# EAGLE schematic MegaShieldDB (EAGLE 6.4)
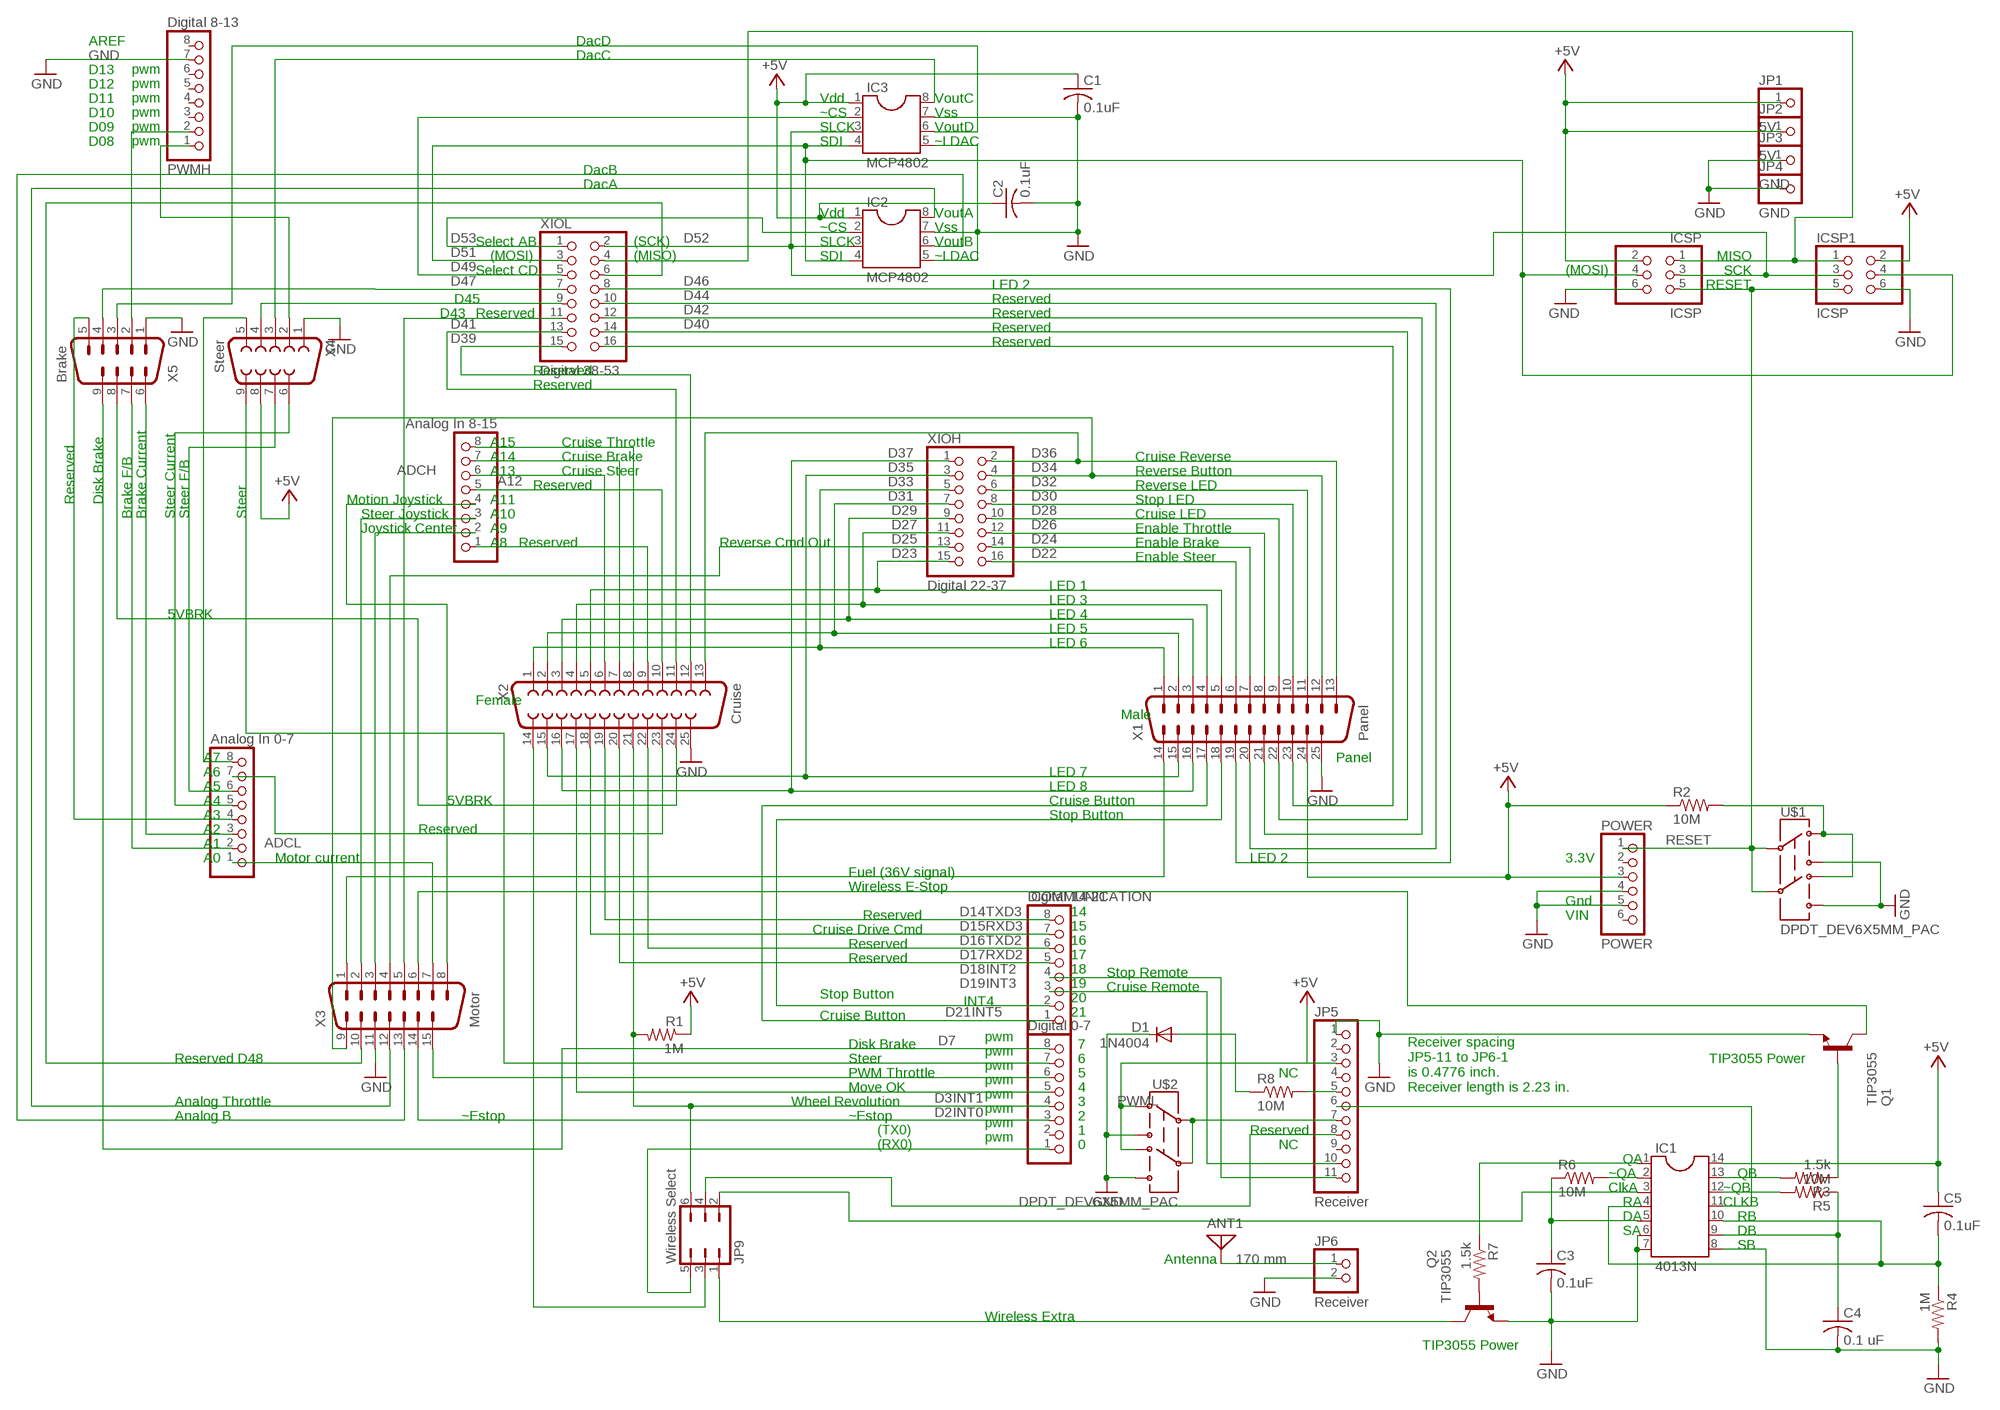
[diagram p0: schematic, sheet 1]

## Parts
ADCH  Analog In 8-15  PINHD-1X8  [1X08]
ADCL  Analog In 0-7  PINHD-1X8  [1X08]
ANT1  170 mm  ANTENNA  [PAD-01]
C1  0.1uF  C-US025-025X050  [C025-025X050]
C2  0.1uF  C-US025-025X050  [C025-025X050]
C3  0.1uF  C-US025-025X050  [C025-025X050]
C4  0.1 uF  C-US025-025X050  [C025-025X050]
C5  0.1uF  C-US025-025X050  [C025-025X050]
COMMUNICATION  Digital 14-21  PINHD-1X8  [1X08]
D1  1N4004  [DO41-10]
IC1  4013N  DIL14  [DIL14]
IC2  MCP4802  DIL8  [DIL08]
IC3  MCP4802  DIL8  [DIL08]
ICSP  ICSP  PINHD-2X3  [2X03]
ICSP1  ICSP  PINHD-2X3  [2X03]
JP1  5V  PINHD-1X1  [1X01]
JP2  5V  PINHD-1X1  [1X01]
JP3  GND  PINHD-1X1  [1X01]
JP4  GND  PINHD-1X1  [1X01]
JP5  Receiver  PINHD-1X11  [1X11]
JP6  Receiver  PINHD-1X2  [1X02]
JP9  Wireless Select  JP3Q  [JP3Q]
POWER  POWER  PINHD-1X6  [1X06]
PWMH  Digital 8-13  PINHD-1X8  [1X08]
PWML  Digital 0-7  PINHD-1X8  [1X08]
Q1  TIP3055  BD239  [TO220]
Q2  TIP3055  BD239  [TO220]
R1  1M  R-US_0204/5  [0204/5]
R2  10M  R-US_0204/5  [0204/5]
R3  1.5k  R-US_0204/5  [0204/5]
R4  1M  R-US_0204/5  [0204/5]
R5  10M  R-US_0204/5  [0204/5]
R6  10M  R-US_0204/5  [0204/5]
R7  1.5k  R-US_0204/5  [0204/5]
R8  10M  R-US_0204/5  [0204/5]
U$1  DPDT_DEV6X5MM_PAC  [NEWSWITCH2_PAC]
U$2  DPDT_DEV6X5MM_PAC  [NEWSWITCH2_PAC]
X1  Panel  M25-HD-20  [M25-HD-20]
X2  Cruise  F25H  [F25H]
X3  Motor  M15-182  [182-015-MALE]
X4  Steer  F09H  [F09H]
X5  Brake  M09-182  [182-009-MALE]
XIOH  Digital 22-37  PINHD-2X8  [2X08]
XIOL  Digital 38-53  PINHD-2X8  [2X08]

## Nets
5VBRK: X2.24 X5.8
+5V: C1.1 C2.1 C5.1 IC1.14 IC2.1 IC3.1 ICSP1.2 ICSP.2 JP1.1 JP2.1 JP5.3 POWER.3 R1.1 R2.1 U$2.PIN1 U$2.PIN4 X1.24 X4.8
A0: ADCL.1 X3.7
A1: ADCL.2 X5.7
A4: ADCL.5 X4.6
A5: ADCL.6 X4.7
A6: ADCL.7 X2.23
A7: ADCL.8 X4.5
A9: ADCH.2 X3.3
A10: ADCH.3 X3.2
A11: ADCH.4 X3.8
A12: ADCH.5 X2.10
A13: ADCH.6 X2.6
A14: ADCH.7 X2.7
A15: ADCH.8 X2.8
CLKA: IC1.3 JP9.2
CLKB: IC1.11 JP5.6
D0RX0: JP9.5 PWML.1
D2INT0: PWML.3 X3.14
D3INT1: JP9.6 PWML.4 R1.2 X2.21
D4: PWML.5 X2.17
D5: PWML.6 X3.15
D6: PWML.7 X4.9
D7: PWML.8 X5.9
D8: PWMH.1 X4.2
D9: PWMH.2 X5.2
D14TXD3: COMMUNICATION.8 X2.19
D15RXD3: COMMUNICATION.7 X2.18
D16TXD2: COMMUNICATION.6 X2.22
D17RXD2: COMMUNICATION.5 X2.20
D18INT2: COMMUNICATION.4 JP5.11
D19INT3: COMMUNICATION.3 JP5.10
D20INT4: COMMUNICATION.2 X1.18
D21INT5: COMMUNICATION.1 X1.17
D22: X1.6 XIOH.16
D23: X1.5 X2.5 XIOH.15
D24: X1.7 XIOH.14
D25: X3.4 XIOH.13
D26: X1.8 XIOH.12
D27: X1.4 X2.4 XIOH.11
D28: X1.9 XIOH.10
D29: X1.3 X2.3 XIOH.9
D30: X1.10 XIOH.8
D31: X1.2 X2.2 XIOH.7
D32: X1.11 XIOH.6
D33: X1.1 X2.1 XIOH.5
D34: X1.12 X3.9 XIOH.4
D35: X1.15 X2.15 XIOH.3
D36: X1.13 X2.13 XIOH.2
D37: X1.16 X2.16 XIOH.1
D38: X1.23 XIOL.16
D39: X2.12 XIOL.15
D40: X1.22 XIOL.14
D41: X2.11 XIOL.13
D42: X1.21 XIOL.12
D43: X3.5 XIOL.11
D44: X1.20 XIOL.10
D45: X4.4 XIOL.9
D46: X1.19 XIOL.8
D47: X5.4 XIOL.7
D48: X3.10 XIOL.6
D49: IC3.2 XIOL.5
D51: IC2.4 IC3.4 ICSP1.4 ICSP.4 XIOL.3
D52: IC2.3 IC3.3 ICSP1.3 ICSP.3 XIOL.2
D53: IC2.2 XIOL.1
DA: C3.1 IC1.5 R6.1
DACA: IC2.8 X3.12
DACB: IC2.6 X3.13
DACC: IC3.8 X4.3
DACD: IC3.6 X5.3
DB: C4.1 IC1.9 R5.1
FUEL: X1.14 X3.1
GND: C1.2 C2.2 C3.2 C4.2 D1.C IC1.6 IC1.7 IC1.8 IC2.5 IC2.7 IC3.5 IC3.7 ICSP1.6 ICSP.6 JP3.1 JP4.1 JP5.1 JP6.2 POWER.4 POWER.5 PWMH.7 Q1.3(E) Q2.3(E) R4.2 U$1.PIN3 U$1.PIN6 U$2.PIN3 U$2.PIN6 X1.25 X2.25 X3.11 X4.1 X5.1
N$1: ADCL.3 X5.6
N$2: IC1.1 R7.1
N$3: Q2.1(B) R7.2
N$4: IC1.13 R3.2
N$5: ADCH.1 X2.9
N$6: R2.2 U$1.PIN1 U$1.PIN4
N$7: IC1.2 R6.2
N$8: ADCL.4 X5.5
N$9: ICSP1.1 ICSP.1 XIOL.4
N$26: ANT1.1 JP6.1
N$28: JP5.7 U$2.PIN2 U$2.PIN5
N$33: Q1.1(B) R3.1
N$40: D1.A R8.1
RA: C5.2 IC1.4 IC1.10 R4.1
RCVR5: JP5.5 R8.2
RESET: ICSP1.5 ICSP.5 POWER.1 U$1.PIN2 U$1.PIN5
WL2: JP5.8 JP9.4
WLES: Q1.2(C) X3.6
WLXCOLL: JP9.1 Q2.2(C)
X2-14: JP9.3 X2.14
~QB: IC1.12 R5.2
Unconnected: JP5.2 JP5.4 JP5.9 POWER.2 POWER.6 PWMH.3 PWMH.4 PWMH.5 PWMH.6 PWMH.8 PWML.2

## Notes on the sheet
- AREF | DacD
- DacC
- D13 | pwm
- D12 | pwm
- D11 | pwm | Vdd | VoutC
- D10 | pwm | ~CS | Vss
- D09 | pwm | SLCK | VoutD
- D08 | pwm | SDI | ~LDAC
- DacB
- DacA
- Vdd | VoutA
- ~CS | Vss
- Select AB | (SCK) | SLCK | VoutB
- (MOSI) | (MISO) | SDI | ~LDAC | MISO
- Select CD | (MOSI) | SCK
- LED 2 | RESET
- D45 | Reserved
- D43 | Reserved | Reserved
- Reserved
- Reserved
- Reserved
- Reserved
- A15 | Cruise Throttle
- A14 | Cruise Brake | Cruise Reverse
- A13 | Cruise Steer | Reverse Button
- Reserved | Reverse LED
- Reserved | Disk Brake | Motion Joystick | A11 | Stop LED
- Brake F/B | Brake Current | Steer Current | Steer F/B | Steer | Steer Joystick | A10 | Cruise LED
- Joystick Center | A9 | Enable Throttle
- A8 | Reserved | Reverse Cmd Out | Enable Brake
- Enable Steer
- LED 1
- LED 3
- 5VBRK | LED 4
- LED 5
- LED 6
- Female
- Male
- A7 | Panel
- A6 | LED 7
- A5 | LED 8
- A4 | 5VBRK | Cruise Button
- A3 | Stop Button
- A2 | Reserved
- A1
- A0 | Motor current | LED 2 | 3.3V
- Fuel (36V signal)
- Wireless E-Stop
- Gnd
- Reserved | 14 | VIN
- Cruise Drive Cmd | 15
- Reserved | 16
- Reserved | 17
- 18 | Stop Remote
- 19 | Cruise Remote
- Stop Button | 20
- INT4
- Cruise Button | 21
- pwm
- Disk Brake | 7
- pwm
- Reserved D48 | Steer | 6 | TIP3055 Power
- pwm
- PWM Throttle | 5 | NC
- pwm
- Move OK | 4
- Receiver spacing
  JP5-11 to JP6-1
  is 0.4776 inch.
  Receiver length is 2.23 in.
- pwm
- Analog Throttle | Wheel Revolution | 3
- pwm
- Analog B | ~Estop | ~Estop | 2
- pwm
- (TX0) | 1 | Reserved
- pwm
- (RX0) | 0 | NC
- QA
- ~QA | QB
- ClkA | ~QB
- RA | CLKB
- DA | RB
- SA | DB
- SB
- Antenna
- Wireless Extra
- TIP3055 Power

## Library data of the parts
ADCH ADCL COMMUNICATION PWMH PWML = pinhead:PINHD-1X8: PIN HEADER
ANT1 = discrete:ANTENNA: Antenna
C1-C5 = rcl:C-US: CAPACITOR, American symbol
D1 = diode:1N4004: DIODE general purpose rectifier, 1 A
IC1 = ic-package:DIL14: Dual In Line / Socket
IC2 IC3 = ic-package:DIL8: Dual In Line / Socket
ICSP ICSP1 = pinhead:PINHD-2X3: PIN HEADER
JP1-JP4 = pinhead:PINHD-1X1: PIN HEADER
JP5 = pinhead:PINHD-1X11: PIN HEADER
JP6 = pinhead:PINHD-1X2: PIN HEADER
JP9 = jumper:JP3Q: JUMPER
POWER = pinhead:PINHD-1X6: PIN HEADER
Q1 Q2 = transistor-neu-to92:BD239: NPN TRANSISTOR Source: http://www.fairchildsemi.com/ds/BD/BD239C.pdf
R1-R8 = rcl:R-US_: RESISTOR, American symbol
U$1 U$2 = elcanoParts:DPDT_DEV
X1 = con-subd:M25-HD-20: HD-20 Front Metal-Shell Right-Angle Posted Connectors 318 Mount 5747846-6 Source: http://catalog.tycoelectronics.com/TE/bin/TE.Connect?C=1&M=BYPN&TCPN=5747846-6&RQPN=5747846-6; OC_FARNELL: unknown; OC_NEWARK: unknown
X2 = con-subd:F25: SUB-D; OC_FARNELL: unknown; OC_NEWARK: unknown
X3 = con-subd:M15: SUB-D; OC_FARNELL: unknown; OC_NEWARK: unknown
X4 = con-subd:F09: SUB-D; OC_FARNELL: unknown; OC_NEWARK: unknown
X5 = con-subd:M09: SUB-D; OC_FARNELL: unknown; OC_NEWARK: unknown
XIOH XIOL = pinhead:PINHD-2X8: PIN HEADER

## Net classes
0 default: width 0.152 mm, drill 0.305 mm, clearance 0.152 mm